# EAGLE schematic folimetro_pcb (EAGLE 6.2)
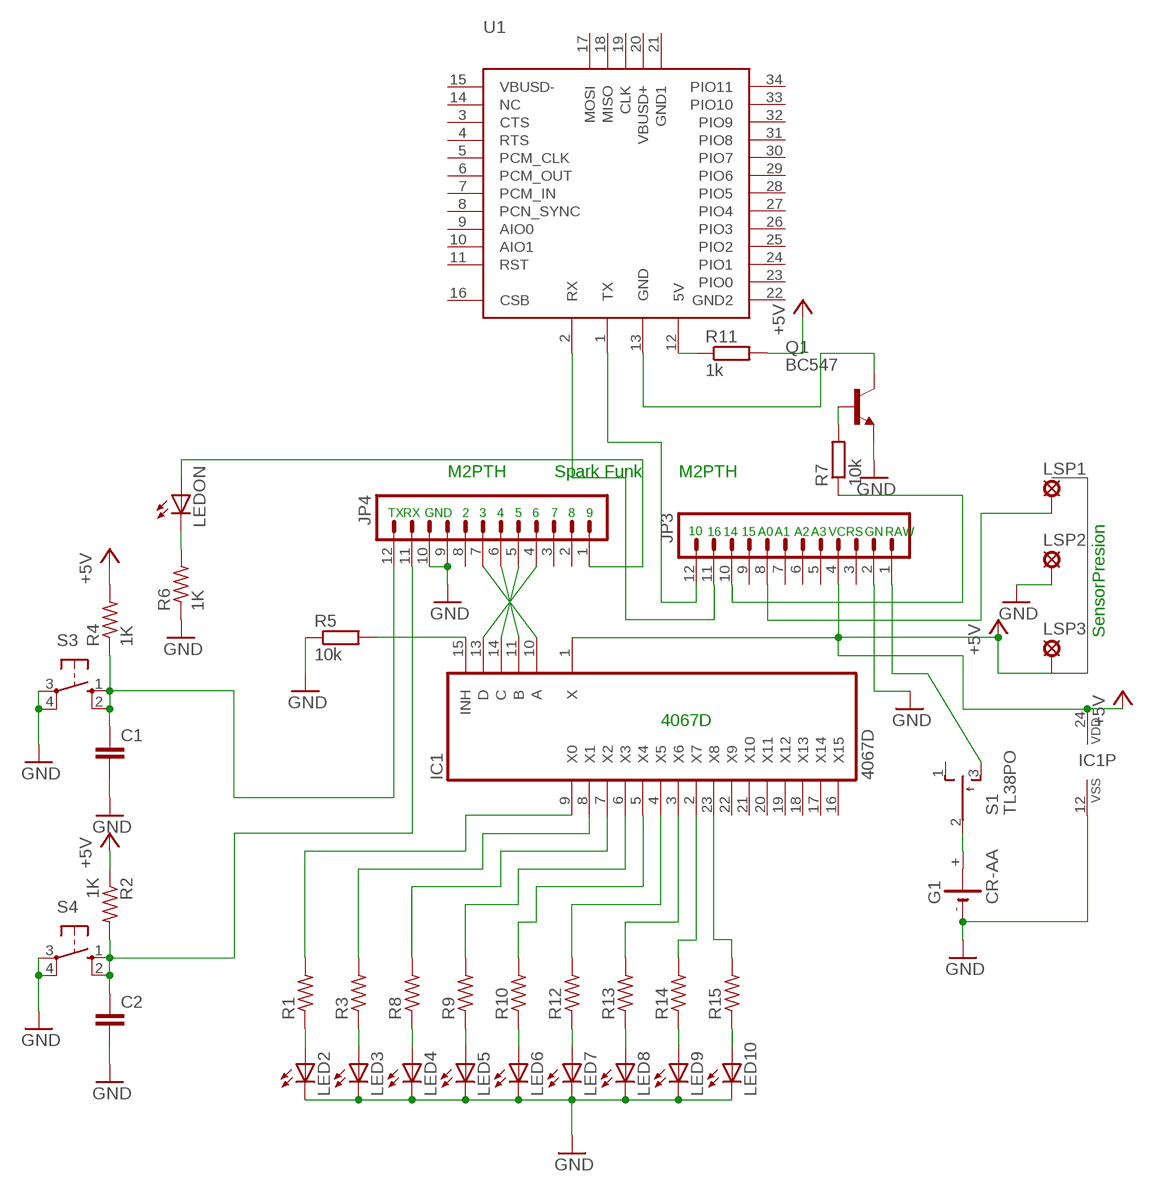
[diagram p0: schematic, sheet 1]

## Parts
C1  C-EUC1206K  [C1206K]
C2  C-EUC1206K  [C1206K]
G1  CR-AA  [CRAA]
IC1  4067D  [SO24W]
JP3  M12PTH  [1X12]
JP4  M12PTH  [1X12]
LED2  LED3MM  [LED3MM]
LED3  LED3MM  [LED3MM]
LED4  LED3MM  [LED3MM]
LED5  LED3MM  [LED3MM]
LED6  LED3MM  [LED3MM]
LED7  LED3MM  [LED3MM]
LED8  LED3MM  [LED3MM]
LED9  LED3MM  [LED3MM]
LED10  LED3MM  [LED3MM]
LEDON  LED3MM  [LED3MM]
LSP1  SE13  [SE13]
LSP2  SE13  [SE13]
LSP3  SE13  [SE13]
Q1  BC547  BC848ALT1SMD  [SOT23]
R1  R-US_R1206  [R1206]
R2  1K  R-US_R1206  [R1206]
R3  R-US_R1206  [R1206]
R4  1K  R-US_R1206  [R1206]
R5  10k  R-EU_R1206  [R1206]
R6  1K  R-US_R1206  [R1206]
R7  10k  R-EU_R1206  [R1206]
R8  R-US_R1206  [R1206]
R9  R-US_R1206  [R1206]
R10  R-US_R1206  [R1206]
R11  1k  R-EU_R1206  [R1206]
R12  R-US_R1206  [R1206]
R13  R-US_R1206  [R1206]
R14  R-US_R1206  [R1206]
R15  R-US_R1206  [R1206]
S1  TL38PO  [TL3XPO]
S3  10-XX  [B3F-10XX]
S4  10-XX  [B3F-10XX]
U1  HC_05  [BLUETOOTH_SMD]

## Nets
+5V: IC1.1(X) IC1.24(VDD) JP3.4 LSP3.MP R2.1 R4.2 R11.2
GND [vcc]: C1.2 C2.2 G1.- IC1.12(VSS) JP3.2 JP4.9 JP4.10 LED2.K(C) LED3.K(C) LED4.K(C) LED5.K(C) LED6.K(C) LED7.K(C) LED8.K(C) LED9.K(C) LED10.K(C) LSP2.MP Q1.2(E) R5.1 R6.1 S3.3(P) S3.4(P1) S4.3(P) S4.4(P1)
N$1: C1.1 JP4.12 R4.1 S3.1(S) S3.2(S1)
N$2: Q1.1(B) R7.2
N$3: IC1.15(INH) R5.2
N$4: IC1.10(A) JP4.7
N$5: IC1.11(B) JP4.6
N$6: IC1.14(C) JP4.5
N$7: IC1.13(D) JP4.4
N$8: R11.1 U1.12(5V)
N$9: IC1.9(X0) R1.2
N$10: LED2.A R1.1
N$11: IC1.8(X1) R3.2
N$12: LED3.A R3.1
N$13: IC1.2(X7) R14.2
N$14: IC1.7(X2) R8.2
N$15: LED4.A R8.1
N$16: IC1.6(X3) R9.2
N$17: LED5.A R9.1
N$18: IC1.5(X4) R10.2
N$19: LED6.A R10.1
N$20: IC1.4(X5) R12.2
N$21: LED7.A R12.1
N$22: IC1.3(X6) R13.2
N$23: LED8.A R13.1
N$24: IC1.23(X8) R15.2
N$25: LED9.A R14.1
N$26: C2.1 JP4.11 R2.2 S4.1(S) S4.2(S1)
N$27: LED10.A R15.1
N$30 [vcc]: Q1.3(C) U1.13(GND)
N$31: G1.+ S1.2(P)
N$32: JP3.11 U1.2(RX)
N$33: JP3.12 U1.1(TX)
N$34: JP3.10 R7.1
N$36: JP3.8 LSP1.MP
N$37: LEDON.K(C) R6.2
N$38: JP4.1 LEDON.A
N$39: JP3.1 S1.3(S)
Unconnected: G1.+@1(+) IC1.16(X15) IC1.17(X14) IC1.18(X13) IC1.19(X12) IC1.20(X11) IC1.21(X10) IC1.22(X9) JP3.3 JP3.5 JP3.6 JP3.7 JP3.9 JP4.2 JP4.3 JP4.8 S1.1(O) U1.3(CTS) U1.4(RTS) U1.5(PCM_CLK) U1.6(PCM_OUT) U1.7(PCM_IN) U1.8(PCN_SYNC) U1.9(AIO0) U1.10(AIO1) U1.11(RST) U1.14(NC) U1.15(VBUSD-) U1.16(CSB) U1.17(MOSI) U1.18(MISO) U1.19(CLK) U1.20(VBUSD+) U1.21(GND1) U1.22(GND2) U1.23(PIO0) U1.24(PIO1) U1.25(PIO2) U1.26(PIO3) U1.27(PIO4) U1.28(PIO5) U1.29(PIO6) U1.30(PIO7) U1.31(PIO8) U1.32(PIO9) U1.33(PIO10) U1.34(PIO11)

## Notes on the sheet
- M2PTH | Spark Funk | M2PTH
- TX | RX | GND | 2 | 3 | 4 | 5 | 6 | 7 | 8 | 9
- 10 | 16 | 14 | 15 | A0 | A1 | A2 | A3 | VC | RS | GN | RAW
- SensorPresion
- 4067D

## Library data of the parts
C1 C2 = rcl:C-EU: CAPACITOR, European symbol
G1 = battery:CR-AA: LI BATTERY Varta CRAA-SLF
IC1 = 40xx:4067: 16-channel ANALOG MULTIPLEXER
JP3 JP4 = SparkFun:M12: Header 12 Standard 12-pin 0.1" header. Use with straight break away headers (SKU : PRT-00116), right angle break away headers (PRT-00553), swiss pins (PRT-00743), machine pins (PRT-00117), and female headers (PRT-00115).
LED2-LED10 LEDON = led:LED: LED OSRAM: - CHIPLED LG R971, LG N971, LY N971, LG Q971, LY Q971, LO R971, LY R971 LH N974, LH R974 LS Q976, LO Q976, LY Q976 LO Q996 - Hyper CHIPLED LW Q18S LB Q993, LB Q99A, LB R99A - SideLED LS A670, LO A670, LY A670, LG A670, LP A670 LB A673, LV A673, LT A673, LW A673 LH A674 LY A675 LS A676, LA A676, LO A676, LY A676, LW A676 LS A679, LY A679, LG A679 - Hyper Micro SIDELED® LS Y876, LA Y876, LO Y876, LY Y876 LT Y87S - SmartLED LW L88C, LW L88S LB L89C, LB L89S, LG L890 LS L89K, LO L89K, LY L89K LS L896, LA L896, LO L896, LY L896 - TOPLED LS T670, LO T670, LY T670, LG T670, LP T670 LSG T670, LSP T670, LSY T670, LOP T670, LYG T670 LG T671, LOG T671, LSG T671 LB T673, LV T673, LT T673, LW T673 LH T674 LS T676, LA T676, LO T676, LY T676, LB T676, LH T676, LSB T676, LW T676 LB T67C, LV T67C, LT T67C, LS T67K, LO T67K, LY T67K, LW E67C LS E67B, LA E67B, LO E67B, LY E67B, LB E67C, LV E67C, LT E67C LW T67C LS T679, LY T679, LG T679 LS T770, LO T770, LY T770, LG T770, LP T770 LB T773, LV T773, LT T773, LW T773 LH T774 LS E675, LA E675, LY E675, LS T675 LS T776, LA T776, LO T776, LY T776, LB T776 LHGB T686 LT T68C, LB T68C - Hyper Mini TOPLED® LB M676 - Mini TOPLED Santana® LG M470 LS M47K, LO M47K, LY M47K Source: http://www.osram.convergy.de LUXEON: - LUMILED® LXK2-PW12-R00, LXK2-PW12-S00, LXK2-PW14-U00, LXK2-PW14-V00 LXK2-PM12-R00, LXK2-PM12-S00, LXK2-PM14-U00 LXK2-PE12-Q00, LXK2-PE12-R00, LXK2-PE12-S00, LXK2-PE14-T00, LXK2-PE14-U00 LXK2-PB12-K00, LXK2-PB12-L00, LXK2-PB12-M00, LXK2-PB14-N00, LXK2-PB14-P00, LXK2-PB14-Q00 LXK2-PR12-L00, LXK2-PR12-M00, LXK2-PR14-Q00, LXK2-PR14-R00 LXK2-PD12-Q00, LXK2-PD12-R00, LXK2-PD12-S00 LXK2-PH12-R00, LXK2-PH12-S00 LXK2-PL12-P00, LXK2-PL12-Q00, LXK2-PL12-R00 Source: www.luxeon.com KINGBRIGHT: KA-3528ASYC Source: www.kingbright.com
LSP1-LSP3 = solpad:SE13: SOLDER PAD E1542, drill 1,3mm, distributor Buerklin, 07F815
Q1 = transistor-npn:BC848*: NPN Transistor
R1-R4 R6 R8-R10 R12-R15 = rcl:R-US_: RESISTOR, American symbol
R5 R7 R11 = resistor:R-EU_: RESISTOR, European symbol
S1 = switch:TL38PO: TINY SWITCH ON OFF MOM Source: http://www2.produktinfo.conrad.com/datenblaetter/700000-724999/705152-da-01-de-Subminiaturschalter_TL_36YO.pdf
S3 S4 = switch-omron:10-XX: OMRON SWITCH; MPN: B3F-1000; OC_FARNELL: 176432; OC_NEWARK: 36M3542
U1 = SerialPortBluetooth:HC_05

## Net classes
0 default: width 0.203 mm